# EasyEDA schematic Relay Board_Rev1-2 - EasyEDA.json
REV: 1.2; Date: 2020-05-30; Sheet: 1/1; Drawn By: Computronics; Company: Sidings Media
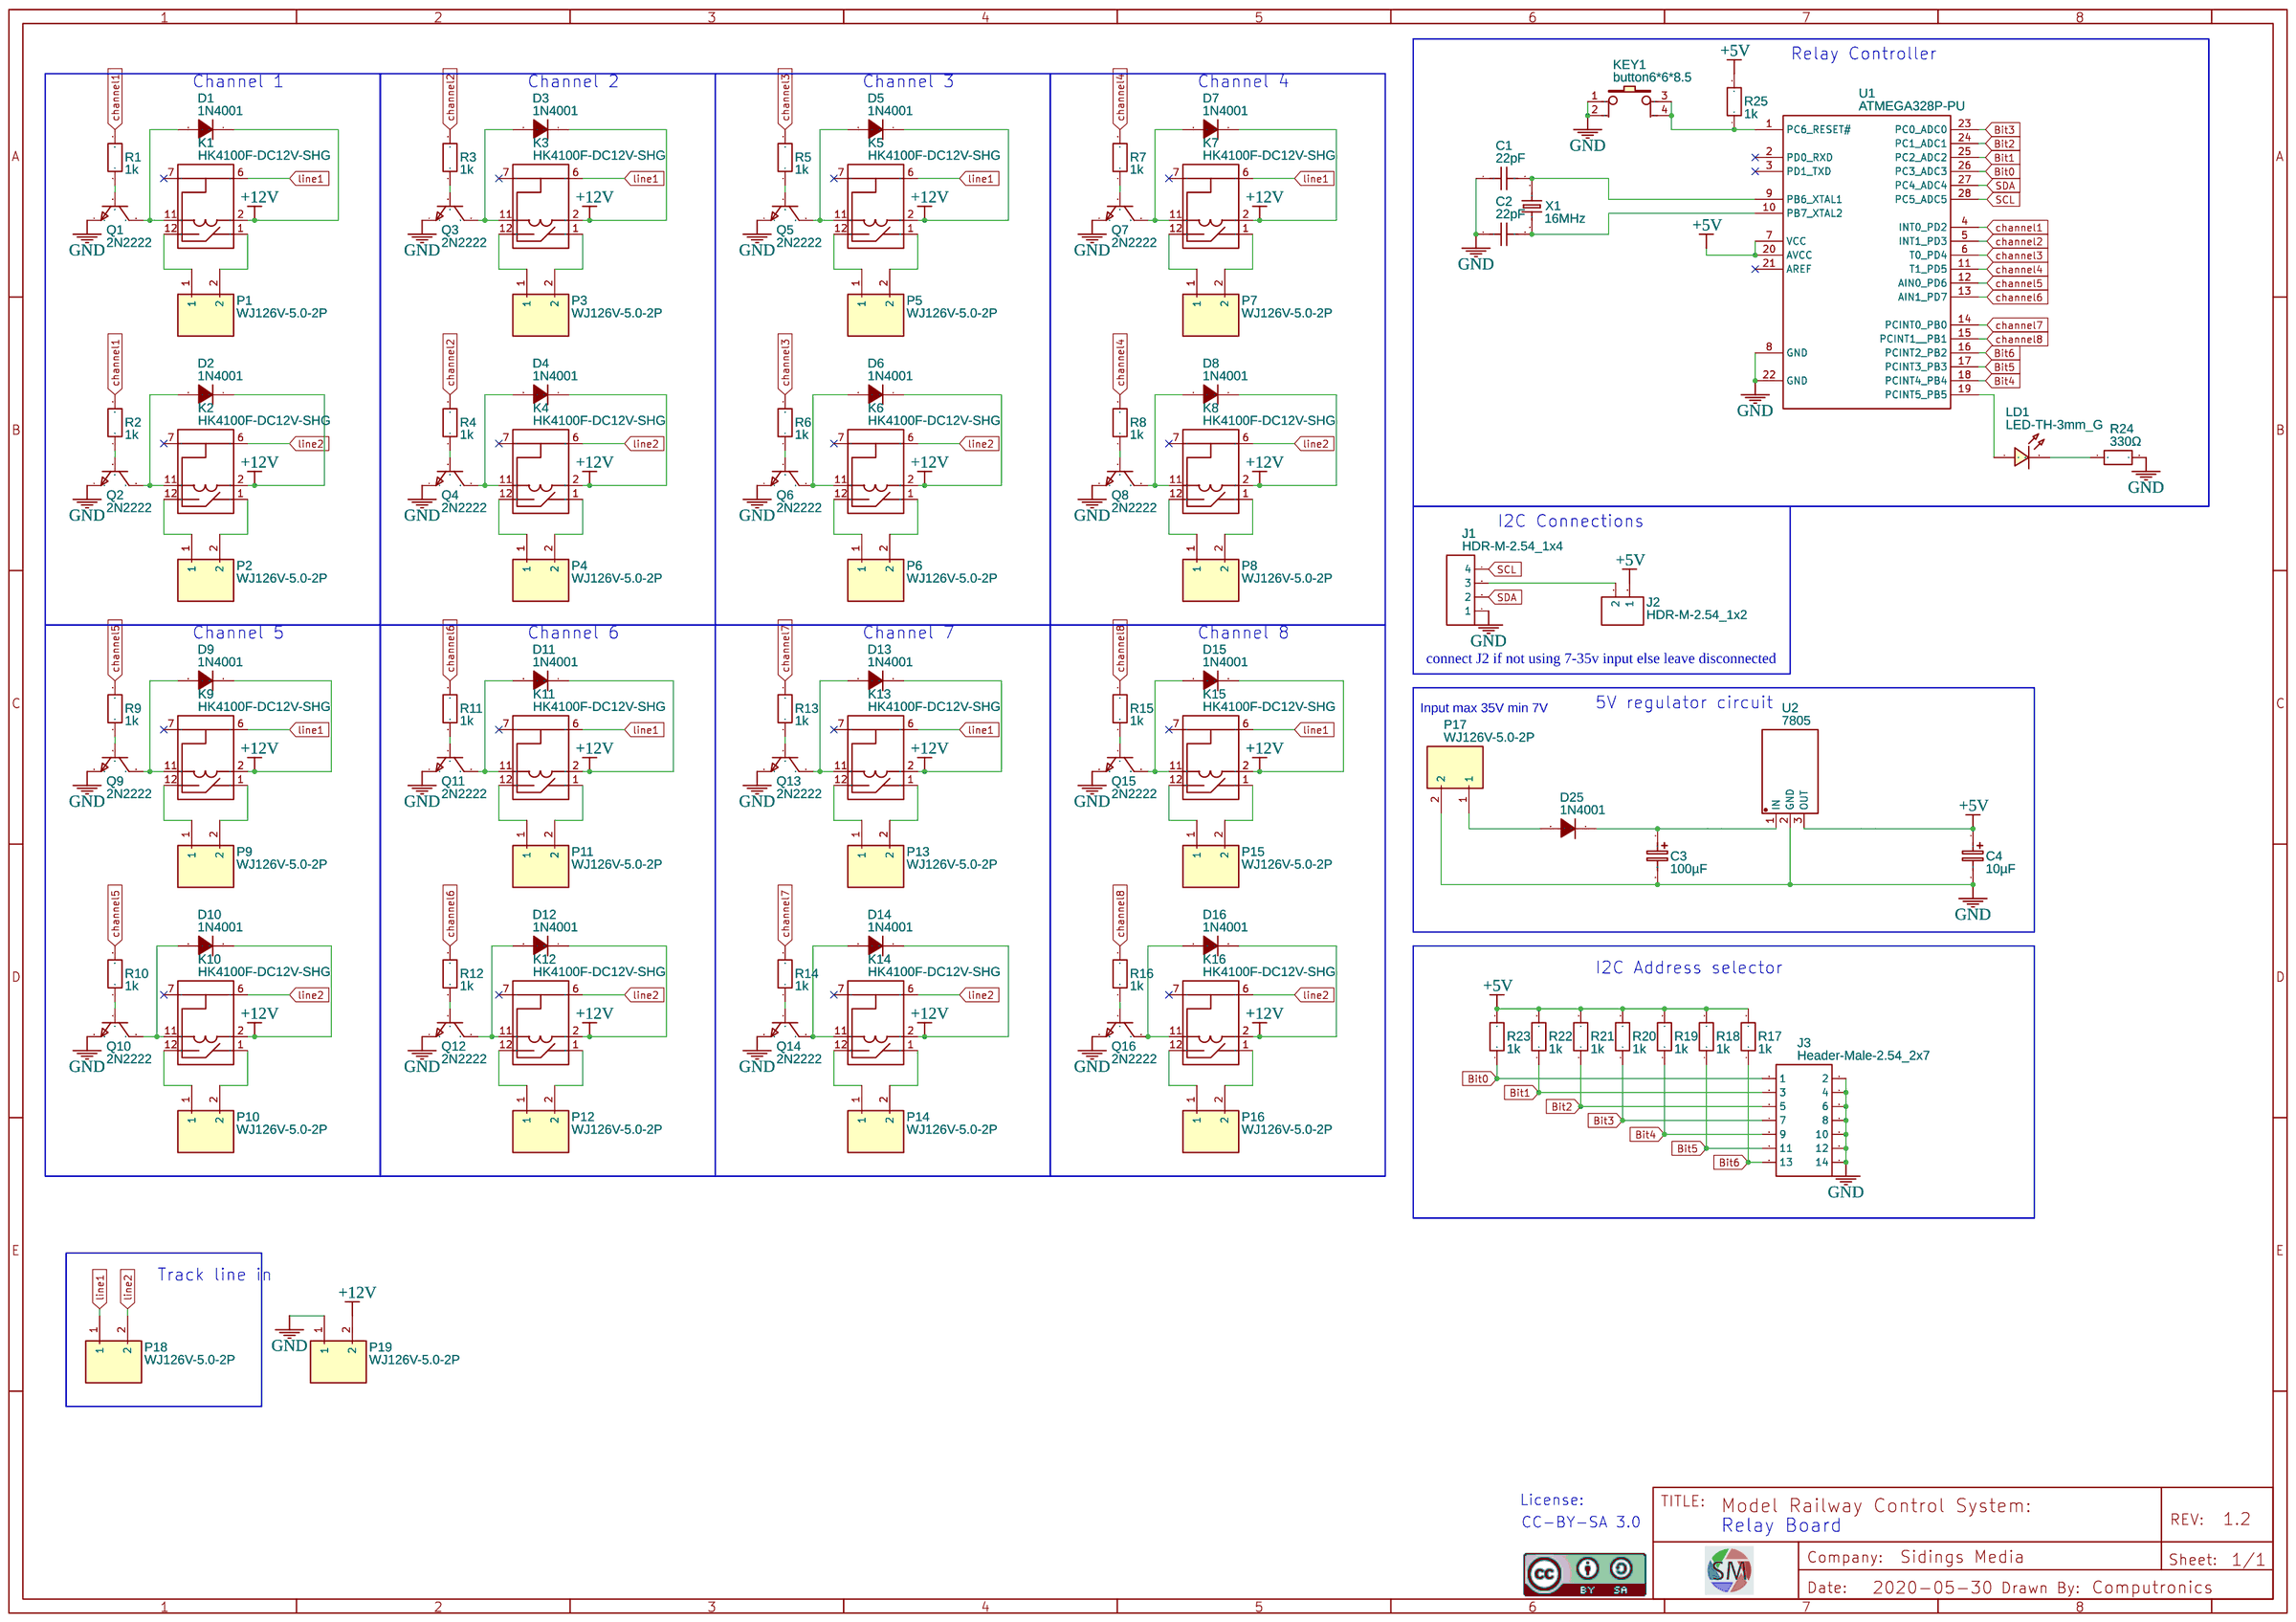
[diagram p0: schematic sheet]

## Parts
C1  22pF  [RAD-0.2]
C2  22pF  [RAD-0.2]
C3  100µF  [CAP-D3.0×F1.5]
C4  10µF  [CAP-D3.0×F1.5]
D1  1N4001  [DO-41_BD2.4-L4.7-P8.70-D0.9-RD]
D2  1N4001  [DO-41_BD2.4-L4.7-P8.70-D0.9-RD]
D3  1N4001  [DO-41_BD2.4-L4.7-P8.70-D0.9-RD]
D4  1N4001  [DO-41_BD2.4-L4.7-P8.70-D0.9-RD]
D5  1N4001  [DO-41_BD2.4-L4.7-P8.70-D0.9-RD]
D6  1N4001  [DO-41_BD2.4-L4.7-P8.70-D0.9-RD]
D7  1N4001  [DO-41_BD2.4-L4.7-P8.70-D0.9-RD]
D8  1N4001  [DO-41_BD2.4-L4.7-P8.70-D0.9-RD]
D9  1N4001  [DO-41_BD2.4-L4.7-P8.70-D0.9-RD]
D10  1N4001  [DO-41_BD2.4-L4.7-P8.70-D0.9-RD]
D11  1N4001  [DO-41_BD2.4-L4.7-P8.70-D0.9-RD]
D12  1N4001  [DO-41_BD2.4-L4.7-P8.70-D0.9-RD]
D13  1N4001  [DO-41_BD2.4-L4.7-P8.70-D0.9-RD]
D14  1N4001  [DO-41_BD2.4-L4.7-P8.70-D0.9-RD]
D15  1N4001  [DO-41_BD2.4-L4.7-P8.70-D0.9-RD]
D16  1N4001  [DO-41_BD2.4-L4.7-P8.70-D0.9-RD]
D25  1N4001  [DO-41_BD2.4-L4.7-P8.70-D0.9-RD]
J1  HDR-M-2.54_1x4  [HDR-M-2.54_1X4]
J2  HDR-M-2.54_1x2  [HDR-M-2.54_1X2]
J3  Header-Male-2.54_2x7  [HDR-TH_14P-P2.54-V-R2-C7-S2.54]
K1  HK4100F-DC12V-SHG  [RELAY-TH_HK4100F-DC12V-SHG]
K2  HK4100F-DC12V-SHG  [RELAY-TH_HK4100F-DC12V-SHG]
K3  HK4100F-DC12V-SHG  [RELAY-TH_HK4100F-DC12V-SHG]
K4  HK4100F-DC12V-SHG  [RELAY-TH_HK4100F-DC12V-SHG]
K5  HK4100F-DC12V-SHG  [RELAY-TH_HK4100F-DC12V-SHG]
K6  HK4100F-DC12V-SHG  [RELAY-TH_HK4100F-DC12V-SHG]
K7  HK4100F-DC12V-SHG  [RELAY-TH_HK4100F-DC12V-SHG]
K8  HK4100F-DC12V-SHG  [RELAY-TH_HK4100F-DC12V-SHG]
K9  HK4100F-DC12V-SHG  [RELAY-TH_HK4100F-DC12V-SHG]
K10  HK4100F-DC12V-SHG  [RELAY-TH_HK4100F-DC12V-SHG]
K11  HK4100F-DC12V-SHG  [RELAY-TH_HK4100F-DC12V-SHG]
K12  HK4100F-DC12V-SHG  [RELAY-TH_HK4100F-DC12V-SHG]
K13  HK4100F-DC12V-SHG  [RELAY-TH_HK4100F-DC12V-SHG]
K14  HK4100F-DC12V-SHG  [RELAY-TH_HK4100F-DC12V-SHG]
K15  HK4100F-DC12V-SHG  [RELAY-TH_HK4100F-DC12V-SHG]
K16  HK4100F-DC12V-SHG  [RELAY-TH_HK4100F-DC12V-SHG]
KEY1  button6*6*8.5  [KEY-TH_4P-L6.0-W6.0-P4.50]
LD1  LED-TH-3mm_G  [LED-TH_BD3.0_GREEN]
P1  WJ126V-5.0-2P  [WJ126V-5.0-2P]
P2  WJ126V-5.0-2P  [WJ126V-5.0-2P]
P3  WJ126V-5.0-2P  [WJ126V-5.0-2P]
P4  WJ126V-5.0-2P  [WJ126V-5.0-2P]
P5  WJ126V-5.0-2P  [WJ126V-5.0-2P]
P6  WJ126V-5.0-2P  [WJ126V-5.0-2P]
P7  WJ126V-5.0-2P  [WJ126V-5.0-2P]
P8  WJ126V-5.0-2P  [WJ126V-5.0-2P]
P9  WJ126V-5.0-2P  [WJ126V-5.0-2P]
P10  WJ126V-5.0-2P  [WJ126V-5.0-2P]
P11  WJ126V-5.0-2P  [WJ126V-5.0-2P]
P12  WJ126V-5.0-2P  [WJ126V-5.0-2P]
P13  WJ126V-5.0-2P  [WJ126V-5.0-2P]
P14  WJ126V-5.0-2P  [WJ126V-5.0-2P]
P15  WJ126V-5.0-2P  [WJ126V-5.0-2P]
P16  WJ126V-5.0-2P  [WJ126V-5.0-2P]
P17  WJ126V-5.0-2P  [WJ126V-5.0-2P]
P18  WJ126V-5.0-2P  [WJ126V-5.0-2P]
P19  WJ126V-5.0-2P  [WJ126V-5.0-2P]
Q1  2N2222  [TO-92-3_L4.9-W3.7-P1.27-L]
Q2  2N2222  [TO-92-3_L4.9-W3.7-P1.27-L]
Q3  2N2222  [TO-92-3_L4.9-W3.7-P1.27-L]
Q4  2N2222  [TO-92-3_L4.9-W3.7-P1.27-L]
Q5  2N2222  [TO-92-3_L4.9-W3.7-P1.27-L]
Q6  2N2222  [TO-92-3_L4.9-W3.7-P1.27-L]
Q7  2N2222  [TO-92-3_L4.9-W3.7-P1.27-L]
Q8  2N2222  [TO-92-3_L4.9-W3.7-P1.27-L]
Q9  2N2222  [TO-92-3_L4.9-W3.7-P1.27-L]
Q10  2N2222  [TO-92-3_L4.9-W3.7-P1.27-L]
Q11  2N2222  [TO-92-3_L4.9-W3.7-P1.27-L]
Q12  2N2222  [TO-92-3_L4.9-W3.7-P1.27-L]
Q13  2N2222  [TO-92-3_L4.9-W3.7-P1.27-L]
Q14  2N2222  [TO-92-3_L4.9-W3.7-P1.27-L]
Q15  2N2222  [TO-92-3_L4.9-W3.7-P1.27-L]
Q16  2N2222  [TO-92-3_L4.9-W3.7-P1.27-L]
R1  1k  [R_AXIAL-0.4]
R2  1k  [R_AXIAL-0.4]
R3  1k  [R_AXIAL-0.4]
R4  1k  [R_AXIAL-0.4]
R5  1k  [R_AXIAL-0.4]
R6  1k  [R_AXIAL-0.4]
R7  1k  [R_AXIAL-0.4]
R8  1k  [R_AXIAL-0.4]
R9  1k  [R_AXIAL-0.4]
R10  1k  [R_AXIAL-0.4]
R11  1k  [R_AXIAL-0.4]
R12  1k  [R_AXIAL-0.4]
R13  1k  [R_AXIAL-0.4]
R14  1k  [R_AXIAL-0.4]
R15  1k  [R_AXIAL-0.4]
R16  1k  [R_AXIAL-0.4]
R17  1k  [R_AXIAL-0.4]
R18  1k  [R_AXIAL-0.4]
R19  1k  [R_AXIAL-0.4]
R20  1k  [R_AXIAL-0.4]
R21  1k  [R_AXIAL-0.4]
R22  1k  [R_AXIAL-0.4]
R23  1k  [R_AXIAL-0.4]
R24  330Ω  [R_AXIAL-0.4]
R25  1k  [R_AXIAL-0.4]
U1  ATMEGA328P-PU  [DIP-28_L34.6-W7.3-P2.54-LS10.2-BL]
U2  7805  [TO-220-3_L10.0-W4.5-P2.54-L]
X1  16MHz  [HC-49US_L11.5-W4.5-P4.88]

## Library data of the parts
C1 C2 = C_RAD-0.2_US: Contributor: LCEDA_Lib
C3 C4 = CE_TH_D3.0×F1.5_EU: Contributor: LCEDA_Lib
D1-D16 D25 = 1N4001: Supplier: LCSC; Manufacturer: LRC; Supplier Part: C82804
J1 = HDR-M-2.54_1x4: Supplier Part: C124378; Supplier: LCSC; Contributor: LCEDA_Lib
J2 = HDR-M-2.54_1x2: Supplier Part: C124375; Supplier: LCSC; Contributor: LCEDA_Lib
J3 = Header-Male-2.54_2x7: Supplier: LCSC; Manufacturer: BOOMELE; Manufacturer Part: Double row of needle2X7P 2.54mm; Supplier Part: C71397
K1-K16 = HK4100F-DC12V-SHG: Supplier: LCSC; Manufacturer: HUIKE; image: //image.lceda.cn/szlcsc/C13467.jpg; Supplier Part: C13467
KEY1 = button6*6*8.5: Supplier Part: C59980; Supplier: LCSC; Manufacturer: ReliaPro; image: http://image.lceda.cn/szlcsc/C59980.jpg
LD1 = LED-TH-3mm_G: Manufacturer: EVERLIGHT(台湾亿光); Manufacturer Part: 204-10SYGD/S530-E3; Supplier Part: C85161; Contributor: LCEDA_Lib
P1-P19 = WJ126V-5.0-2P: Supplier: LCSC; Manufacturer: ReliaPro; image: //image.lceda.cn/szlcsc/C8404.jpg; Supplier Part: C8404
Q1-Q16 = 2N2222: Supplier: LCSC; Manufacturer: SEMTECH; Contributor: LCSC; Supplier Part: C118536
R1-R25 = R_AXIAL-0.4_EU: Contributor: LCEDA_Lib
U1 = ATMEGA328P-PU: sourceId: Oic6oiASL; Supplier: LCSC; Manufacturer: MICROCHIP; image: //image.lceda.cn/szlcsc/C33901.jpg; Contributor: LCSC; Supplier Part: C33901
U2 = 7805: Supplier: LCSC; Supplier Part: C305416; Manufacturer: Foshan Blue Rocket Elec; Contributor: LCSC
X1 = XIHCELNANF-16MHZ: Supplier: LCSC; Supplier Part: C295075; Manufacturer: TAITIEN Elec; Contributor: LCSC

## Nets
+5V: C4.1 J2.1 R17.2 R18.2 R19.2 R20.2 R21.2 R22.2 R23.2 R25.2 U1.7(VCC) U1.20(AVCC) U2.3(OUT)
+12V: D1.1(K) D2.1(K) D3.1(K) D4.1(K) D5.1(K) D6.1(K) D7.1(K) D8.1(K) D9.1(K) D10.1(K) D11.1(K) D12.1(K) D13.1(K) D14.1(K) D15.1(K) D16.1(K) K1.2 K2.2 K3.2 K4.2 K5.2 K6.2 K7.2 K8.2 K9.2 K10.2 K11.2 K12.2 K13.2 K14.2 K15.2 K16.2 P19.2
GND: C1.1 C2.1 C3.2 C4.2 J1.1 J3.2 J3.4 J3.6 J3.8 J3.10 J3.12 J3.14 KEY1.1 KEY1.2 P17.2 P19.1 Q1.1(E) Q2.1(E) Q3.1(E) Q4.1(E) Q5.1(E) Q6.1(E) Q7.1(E) Q8.1(E) Q9.1(E) Q10.1(E) Q11.1(E) Q12.1(E) Q13.1(E) Q14.1(E) Q15.1(E) Q16.1(E) R24.2 U1.8(GND) U1.22(GND) U2.2(GND)
Bit0: J3.1 R23.1 U1.26(PC3 ADC3)
Bit1: J3.3 R22.1 U1.25(PC2 ADC2)
Bit2: J3.5 R21.1 U1.24(PC1 ADC1)
Bit3: J3.7 R20.1 U1.23(PC0 ADC0)
Bit4: J3.9 R19.1 U1.18(PCINT4 PB4)
Bit5: J3.11 R18.1 U1.17(PCINT3 PB3)
Bit6: J3.13 R17.1 U1.16(PCINT2 PB2)
channel1: R1.2 R2.2 U1.4(INT0 PD2)
channel2: R3.2 R4.2 U1.5(INT1 PD3)
channel3: R5.2 R6.2 U1.6(T0 PD4)
channel4: R7.2 R8.2 U1.11(T1 PD5)
channel5: R9.2 R10.2 U1.12(AIN0 PD6)
channel6: R11.2 R12.2 U1.13(AIN1 PD7)
channel7: R13.2 R14.2 U1.14(PCINT0 PB0)
channel8: R15.2 R16.2 U1.15(PCINT1  PB1)
line1: K1.6 K3.6 K5.6 K7.6 K9.6 K11.6 K13.6 K15.6 P18.1
line2: K2.6 K4.6 K6.6 K8.6 K10.6 K12.6 K14.6 K16.6 P18.2
SCL: J1.4 U1.28(PC5 ADC5)
SDA: J1.2 U1.27(PC4 ADC4)
Net-(C1-2): C1.2 U1.9(PB6 XTAL1) X1.1
Net-(C2-2): C2.2 U1.10(PB7 XTAL2) X1.2
Net-(C3-1): C3.1 D25.1(K) U2.1(IN)
Net-(D1-2): D1.2(A) K1.11 Q1.3(C)
Net-(D2-2): D2.2(A) K2.11 Q2.3(C)
Net-(D3-2): D3.2(A) K3.11 Q3.3(C)
Net-(D4-2): D4.2(A) K4.11 Q4.3(C)
Net-(D5-2): D5.2(A) K5.11 Q5.3(C)
Net-(D6-2): D6.2(A) K6.11 Q6.3(C)
Net-(D7-2): D7.2(A) K7.11 Q7.3(C)
Net-(D8-2): D8.2(A) K8.11 Q8.3(C)
Net-(D9-2): D9.2(A) K9.11 Q9.3(C)
Net-(D10-2): D10.2(A) K10.11 Q10.3(C)
Net-(D11-2): D11.2(A) K11.11 Q11.3(C)
Net-(D12-2): D12.2(A) K12.11 Q12.3(C)
Net-(D13-2): D13.2(A) K13.11 Q13.3(C)
Net-(D14-2): D14.2(A) K14.11 Q14.3(C)
Net-(D15-2): D15.2(A) K15.11 Q15.3(C)
Net-(D16-2): D16.2(A) K16.11 Q16.3(C)
Net-(D25-2): D25.2(A) P17.1
Net-(J1-3): J1.3 J2.2
Net-(K1-1): K1.1 P1.2
Net-(K1-12): K1.12 P1.1
Net-(K2-1): K2.1 P2.2
Net-(K2-12): K2.12 P2.1
Net-(K3-1): K3.1 P3.2
Net-(K3-12): K3.12 P3.1
Net-(K4-1): K4.1 P4.2
Net-(K4-12): K4.12 P4.1
Net-(K5-1): K5.1 P5.2
Net-(K5-12): K5.12 P5.1
Net-(K6-1): K6.1 P6.2
Net-(K6-12): K6.12 P6.1
Net-(K7-1): K7.1 P7.2
Net-(K7-12): K7.12 P7.1
Net-(K8-1): K8.1 P8.2
Net-(K8-12): K8.12 P8.1
Net-(K9-1): K9.1 P9.2
Net-(K9-12): K9.12 P9.1
Net-(K10-1): K10.1 P10.2
Net-(K10-12): K10.12 P10.1
Net-(K11-1): K11.1 P11.2
Net-(K11-12): K11.12 P11.1
Net-(K12-1): K12.1 P12.2
Net-(K12-12): K12.12 P12.1
Net-(K13-1): K13.1 P13.2
Net-(K13-12): K13.12 P13.1
Net-(K14-1): K14.1 P14.2
Net-(K14-12): K14.12 P14.1
Net-(K15-1): K15.1 P15.2
Net-(K15-12): K15.12 P15.1
Net-(K16-1): K16.1 P16.2
Net-(K16-12): K16.12 P16.1
Net-(KEY1-3): KEY1.3 KEY1.4 R25.1 U1.1(PC6 RESET#)
Net-(LD1-1): LD1.1 U1.19(PCINT5 PB5)
Net-(LD1-2): LD1.2 R24.1
Net-(Q1-2): Q1.2(B) R1.1
Net-(Q2-2): Q2.2(B) R2.1
Net-(Q3-2): Q3.2(B) R3.1
Net-(Q4-2): Q4.2(B) R4.1
Net-(Q5-2): Q5.2(B) R5.1
Net-(Q6-2): Q6.2(B) R6.1
Net-(Q7-2): Q7.2(B) R7.1
Net-(Q8-2): Q8.2(B) R8.1
Net-(Q9-2): Q9.2(B) R9.1
Net-(Q10-2): Q10.2(B) R10.1
Net-(Q11-2): Q11.2(B) R11.1
Net-(Q12-2): Q12.2(B) R12.1
Net-(Q13-2): Q13.2(B) R13.1
Net-(Q14-2): Q14.2(B) R14.1
Net-(Q15-2): Q15.2(B) R15.1
Net-(Q16-2): Q16.2(B) R16.1

Not connected (* = marked no-connect by the designer): K1 7*; K2 7*; K3 7*; K4 7*; K5 7*; K6 7*; K7 7*; K8 7*; K9 7*; K10 7*; K11 7*; K12 7*; K13 7*; K14 7*; K15 7*; K16 7*; U1 2(PD0 RXD)* 3(PD1 TXD)* 21(AREF)*

## Notes on the sheet
- Relay Controller
- Channel 1
- Channel 2
- Channel 3
- Channel 4
- I2C Connections
- Channel 5
- Channel 6
- Channel 7
- Channel 8
- connect J2 if not using 7-35v input else leave disconnected
- Input max 35V min 7V
- 5V regulator circuit
- I2C Address selector
- Track line in
- License:
- CC-BY-SA 3.0
- Relay Board
